# EAGLE schematic LM7805_solutions (EAGLE 9.6.1)
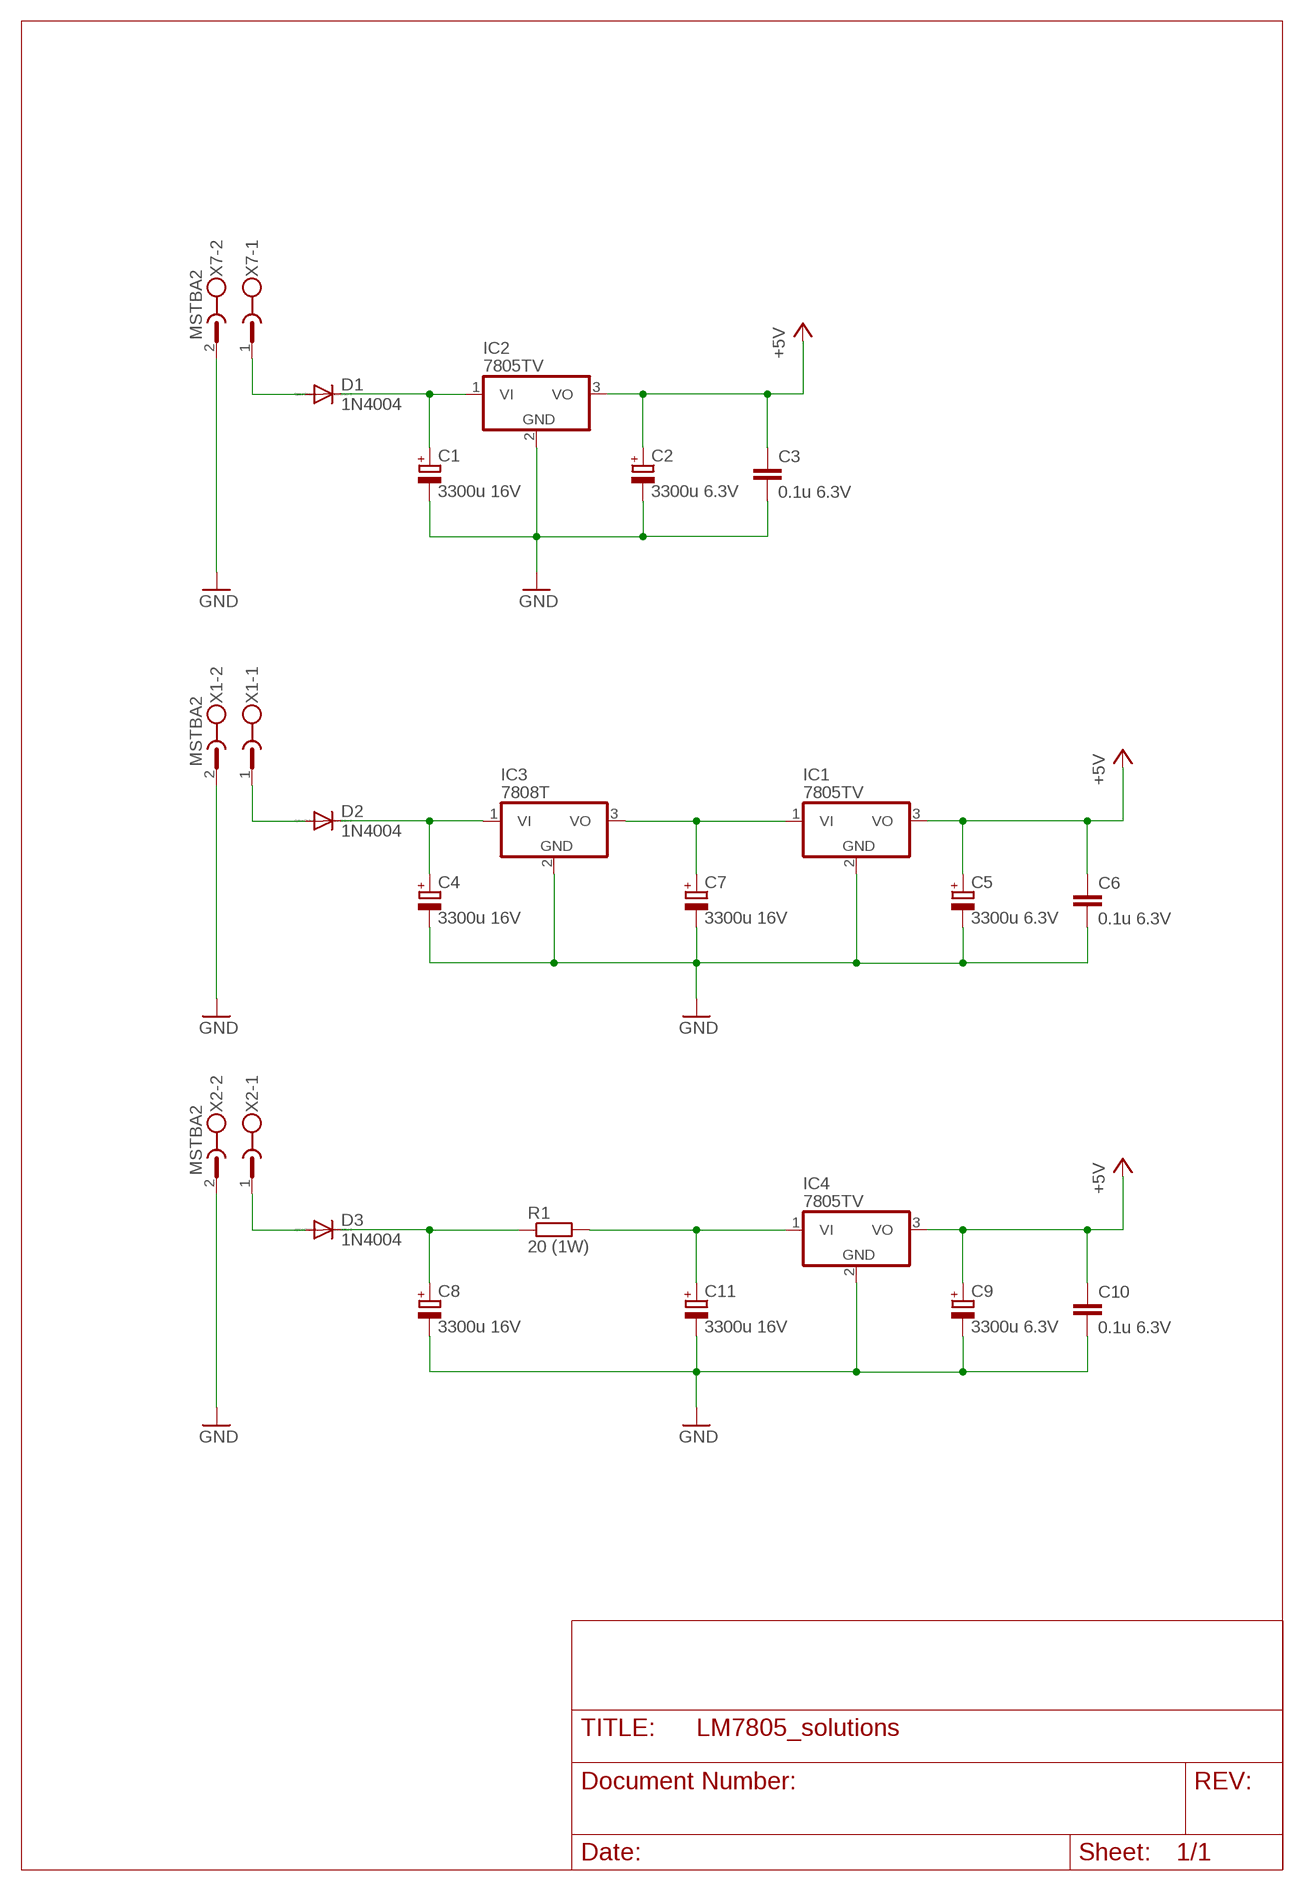
[diagram p0: schematic, sheet 1]

## Parts
C1  3300u 16V  CPOL-EUE10-20  [EB20D]
C2  3300u 6.3V  CPOL-EUE10-20  [EB20D]
C3  0.1u 6.3V  C-EU050-030X075  [C050-030X075]
C4  3300u 16V  CPOL-EUE10-20  [EB20D]
C5  3300u 6.3V  CPOL-EUE10-20  [EB20D]
C6  0.1u 6.3V  C-EU050-030X075  [C050-030X075]
C7  3300u 16V  CPOL-EUE10-20  [EB20D]
C8  3300u 16V  CPOL-EUE10-20  [EB20D]
C9  3300u 6.3V  CPOL-EUE10-20  [EB20D]
C10  0.1u 6.3V  C-EU050-030X075  [C050-030X075]
C11  3300u 16V  CPOL-EUE10-20  [EB20D]
D1  1N4004  [DO41-10]
D2  1N4004  [DO41-10]
D3  1N4004  [DO41-10]
IC1  7805TV  [TO220V]
IC2  7805TV  [TO220V]
IC3  7808T  [TO220H]
IC4  7805TV  [TO220V]
R1  20 (1W)  R-EU_0411/15  [0411/15]
X1  MSTBA2  [MSTBA2]
X2  MSTBA2  [MSTBA2]
X7  MSTBA2  [MSTBA2]

## Nets
+5V: C2.+ C3.1 C5.+ C6.1 C9.+ C10.1 IC1.3(VO) IC2.3(VO) IC4.3(VO)
GND: C1.- C2.- C3.2 C4.- C5.- C6.2 C7.- C8.- C9.- C10.2 C11.- IC1.2(GND) IC2.2(GND) IC3.2(GND) IC4.2(GND) X1.2 X2.2 X7.2
N$1: D1.A X7.1
N$2: D2.A X1.1
N$3: C1.+ D1.C IC2.1(VI)
N$4: C4.+ D2.C IC3.1(VI)
N$5: D3.A X2.1
N$6: C7.+ IC1.1(VI) IC3.3(VO)
N$7: C8.+ D3.C R1.1
N$8: C11.+ IC4.1(VI) R1.2

## Library data of the parts
C1 C2 C4 C5 C7-C9 C11 = resistor:CPOL-EU: POLARIZED CAPACITOR, European symbol
C3 C6 C10 = rcl:C-EU: CAPACITOR, European symbol; SPICEPREFIX: C
D1-D3 = diode:1N4004: DIODE general purpose rectifier, 1 A
IC1-IC4 = linear:78*: Positive VOLTAGE REGULATOR Source: http://cache.national.com/ds/LM/LM78L05.pdf http://www.fairchildsemi.com/ds/LM/LM7805.pdf
R1 = resistor:R-EU_: RESISTOR, European symbol
X1 X2 X7 = con-phoenix-508:MSTBA2: PHOENIX; MF: FARNELL; MPN: 1757242; OC_FARNELL: 3705171; OC_NEWARK: 71C4161